# EAGLE schematic PortableECG (EAGLE 7.5.0)
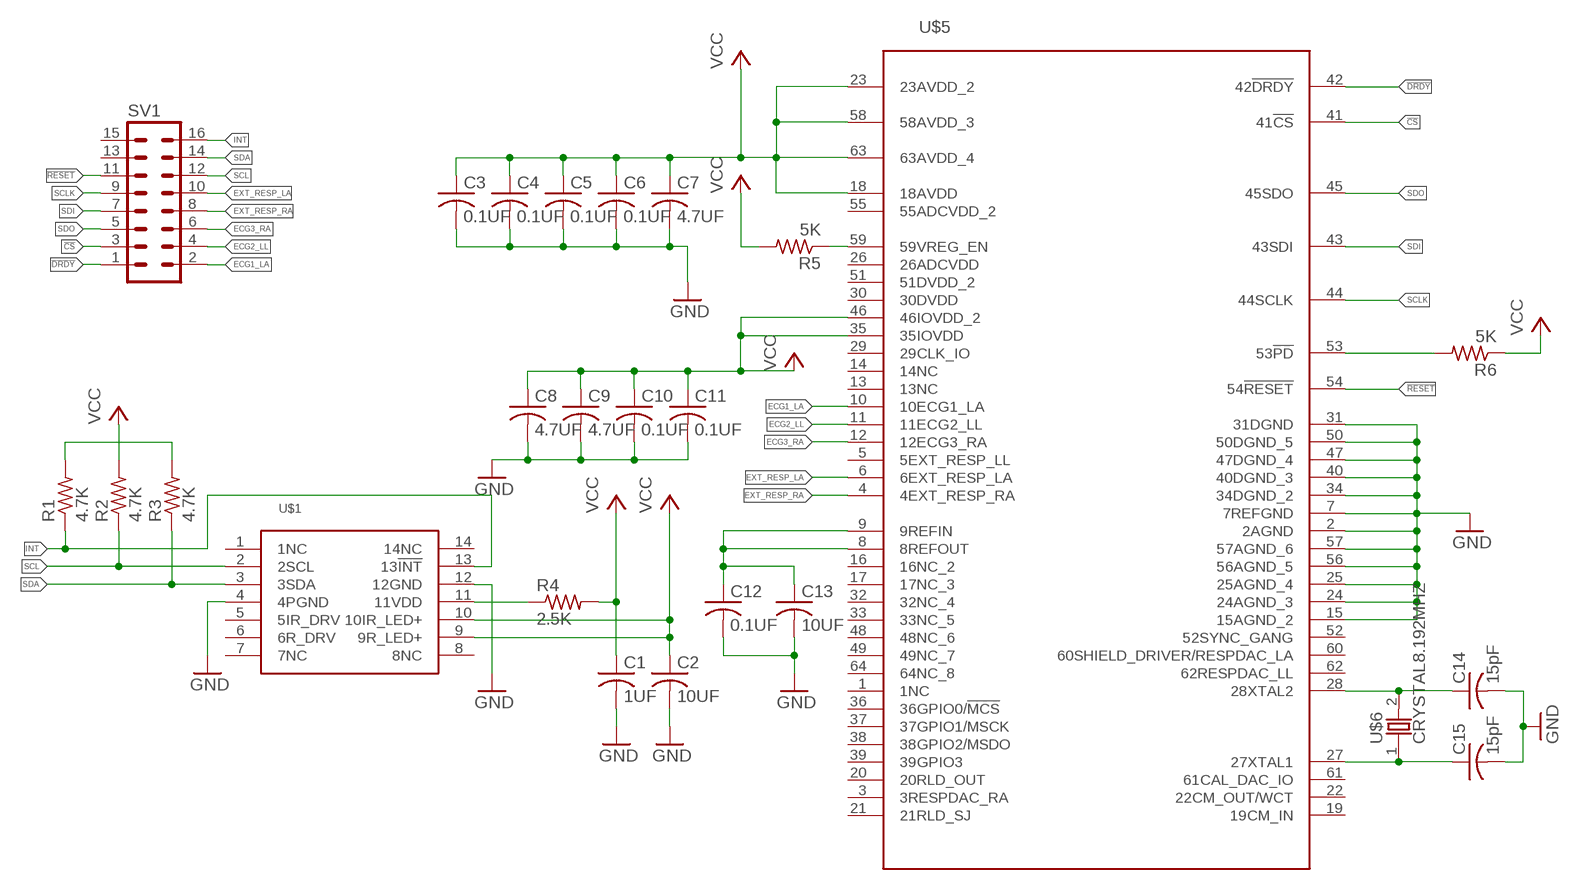
[diagram p0: schematic, sheet 1]

## Parts
C1  1UF  C-US075-063X106  [C075-063X106]
C2  10UF  C-US075-063X106  [C075-063X106]
C3  0.1UF  C-US075-063X106  [C075-063X106]
C4  0.1UF  C-US075-063X106  [C075-063X106]
C5  0.1UF  C-US075-063X106  [C075-063X106]
C6  0.1UF  C-US075-063X106  [C075-063X106]
C7  4.7UF  C-US075-063X106  [C075-063X106]
C8  4.7UF  C-US075-063X106  [C075-063X106]
C9  4.7UF  C-US075-063X106  [C075-063X106]
C10  0.1UF  C-US075-063X106  [C075-063X106]
C11  0.1UF  C-US075-063X106  [C075-063X106]
C12  0.1UF  C-US075-063X106  [C075-063X106]
C13  10UF  C-US075-063X106  [C075-063X106]
C14  15pF  C-US075-063X106  [C075-063X106]
C15  15pF  C-US075-063X106  [C075-063X106]
R1  4.7K  R-US_0207/12  [0207/12]
R2  4.7K  R-US_0207/12  [0207/12]
R3  4.7K  R-US_0207/12  [0207/12]
R4  2.5K  R-US_0207/12  [0207/12]
R5  5K  R-US_0207/12  [0207/12]
R6  5K  R-US_0207/12  [0207/12]
SV1  16P  [16P]
U$1  MAX30100DP  [MAX30100DP]
U$5  ADAS1000-4BSTZDP  [ADAS1000-4BSTZDP]
U$6  CRYSTAL8.192MHZ  [CRYSTAL8.192MHZ]

## Nets
!CS: SV1.3 U$5.41(41!CS)
!DRDY: SV1.1 U$5.42(42!DRDY)
!RESET: SV1.11 U$5.54(54!RESET)
ECG1_LA: SV1.2 U$5.10(10ECG1_LA)
ECG2_LL: SV1.4 U$5.11(11ECG2_LL)
ECG3_RA: SV1.6 U$5.12(12ECG3_RA)
EXT_RESP_LA: SV1.10 U$5.6(6EXT_RESP_LA)
EXT_RESP_RA: SV1.8 U$5.4(4EXT_RESP_RA)
GND: C1.2 C2.2 C3.2 C4.2 C5.2 C6.2 C7.2 C8.2 C9.2 C10.2 C11.2 C12.2 C13.2 C14.2 C15.2 U$1.4(4PGND) U$1.12(12GND) U$5.2(2AGND) U$5.7(7REFGND) U$5.15(15AGND_2) U$5.24(24AGND_3) U$5.25(25AGND_4) U$5.31(31DGND) U$5.34(34DGND_2) U$5.40(40DGND_3) U$5.47(47DGND_4) U$5.50(50DGND_5) U$5.56(56AGND_5) U$5.57(57AGND_6)
INT: R1.1 SV1.16 U$1.13(13!INT)
N$1: R1.2 R3.2
N$2: R5.1 U$5.59(59VREG_EN)
N$3: R4.1 U$1.11(11VDD)
N$4: C14.1 U$5.28(28XTAL2) U$6.2
N$5: C12.1 C13.1 U$5.8(8REFOUT) U$5.9(9REFIN)
N$6: C15.1 U$5.27(27XTAL1) U$6.1
N$7: R6.2 U$5.53(53!PD)
SCL: R2.1 SV1.12 U$1.2(2SCL)
SCLK: SV1.9 U$5.44(44SCLK)
SDA: R3.1 SV1.14 U$1.3(3SDA)
SDI: SV1.7 U$5.43(43SDI)
SDO: SV1.5 U$5.45(45SDO)
VCC: C1.1 C2.1 C3.1 C4.1 C5.1 C6.1 C7.1 C8.1 C9.1 C10.1 C11.1 R2.2 R4.2 R5.2 R6.1 U$1.9(9R_LED+) U$1.10(10IR_LED+) U$5.18(18AVDD) U$5.23(23AVDD_2) U$5.35(35IOVDD) U$5.46(46IOVDD_2) U$5.58(58AVDD_3) U$5.63(63AVDD_4)
Unconnected: SV1.13 SV1.15 U$1.1(1NC) U$1.5(5IR_DRV) U$1.6(6R_DRV) U$1.7(7NC) U$1.8(8NC) U$1.14(14NC) U$5.1(1NC) U$5.3(3RESPDAC_RA) U$5.5(5EXT_RESP_LL) U$5.13(13NC) U$5.14(14NC) U$5.16(16NC_2) U$5.17(17NC_3) U$5.19(19CM_IN) U$5.20(20RLD_OUT) U$5.21(21RLD_SJ) U$5.22(22CM_OUT/WCT) U$5.26(26ADCVDD) U$5.29(29CLK_IO) U$5.30(30DVDD) U$5.32(32NC_4) U$5.33(33NC_5) U$5.36(36GPIO0/!MCS) U$5.37(37GPIO1/MSCK) U$5.38(38GPIO2/MSDO) U$5.39(39GPIO3) U$5.48(48NC_6) U$5.49(49NC_7) U$5.51(51DVDD_2) U$5.52(52SYNC_GANG) U$5.55(55ADCVDD_2) U$5.60(60SHIELD_DRIVER/RESPDAC_LA) U$5.61(61CAL_DAC_IO) U$5.62(62RESPDAC_LL) U$5.64(64NC_8)

## Library data of the parts
C1-C15 = rcl:C-US: CAPACITOR, American symbol
R1-R6 = resistor:R-US_: RESISTOR, American symbol
SV1 = con-dil:16P: DIL CABLE CONNECTOR
U$1 = max30100DP:MAX30100DP
U$5 = ADAS1000-4BSTZDP:ADAS1000-4BSTZDP
U$6 = Crystal 8.192MHz:CRYSTAL8.192MHZ